# Altium schematic sheet 14 WIFI BT.SchDoc
size 513 x 386 mm
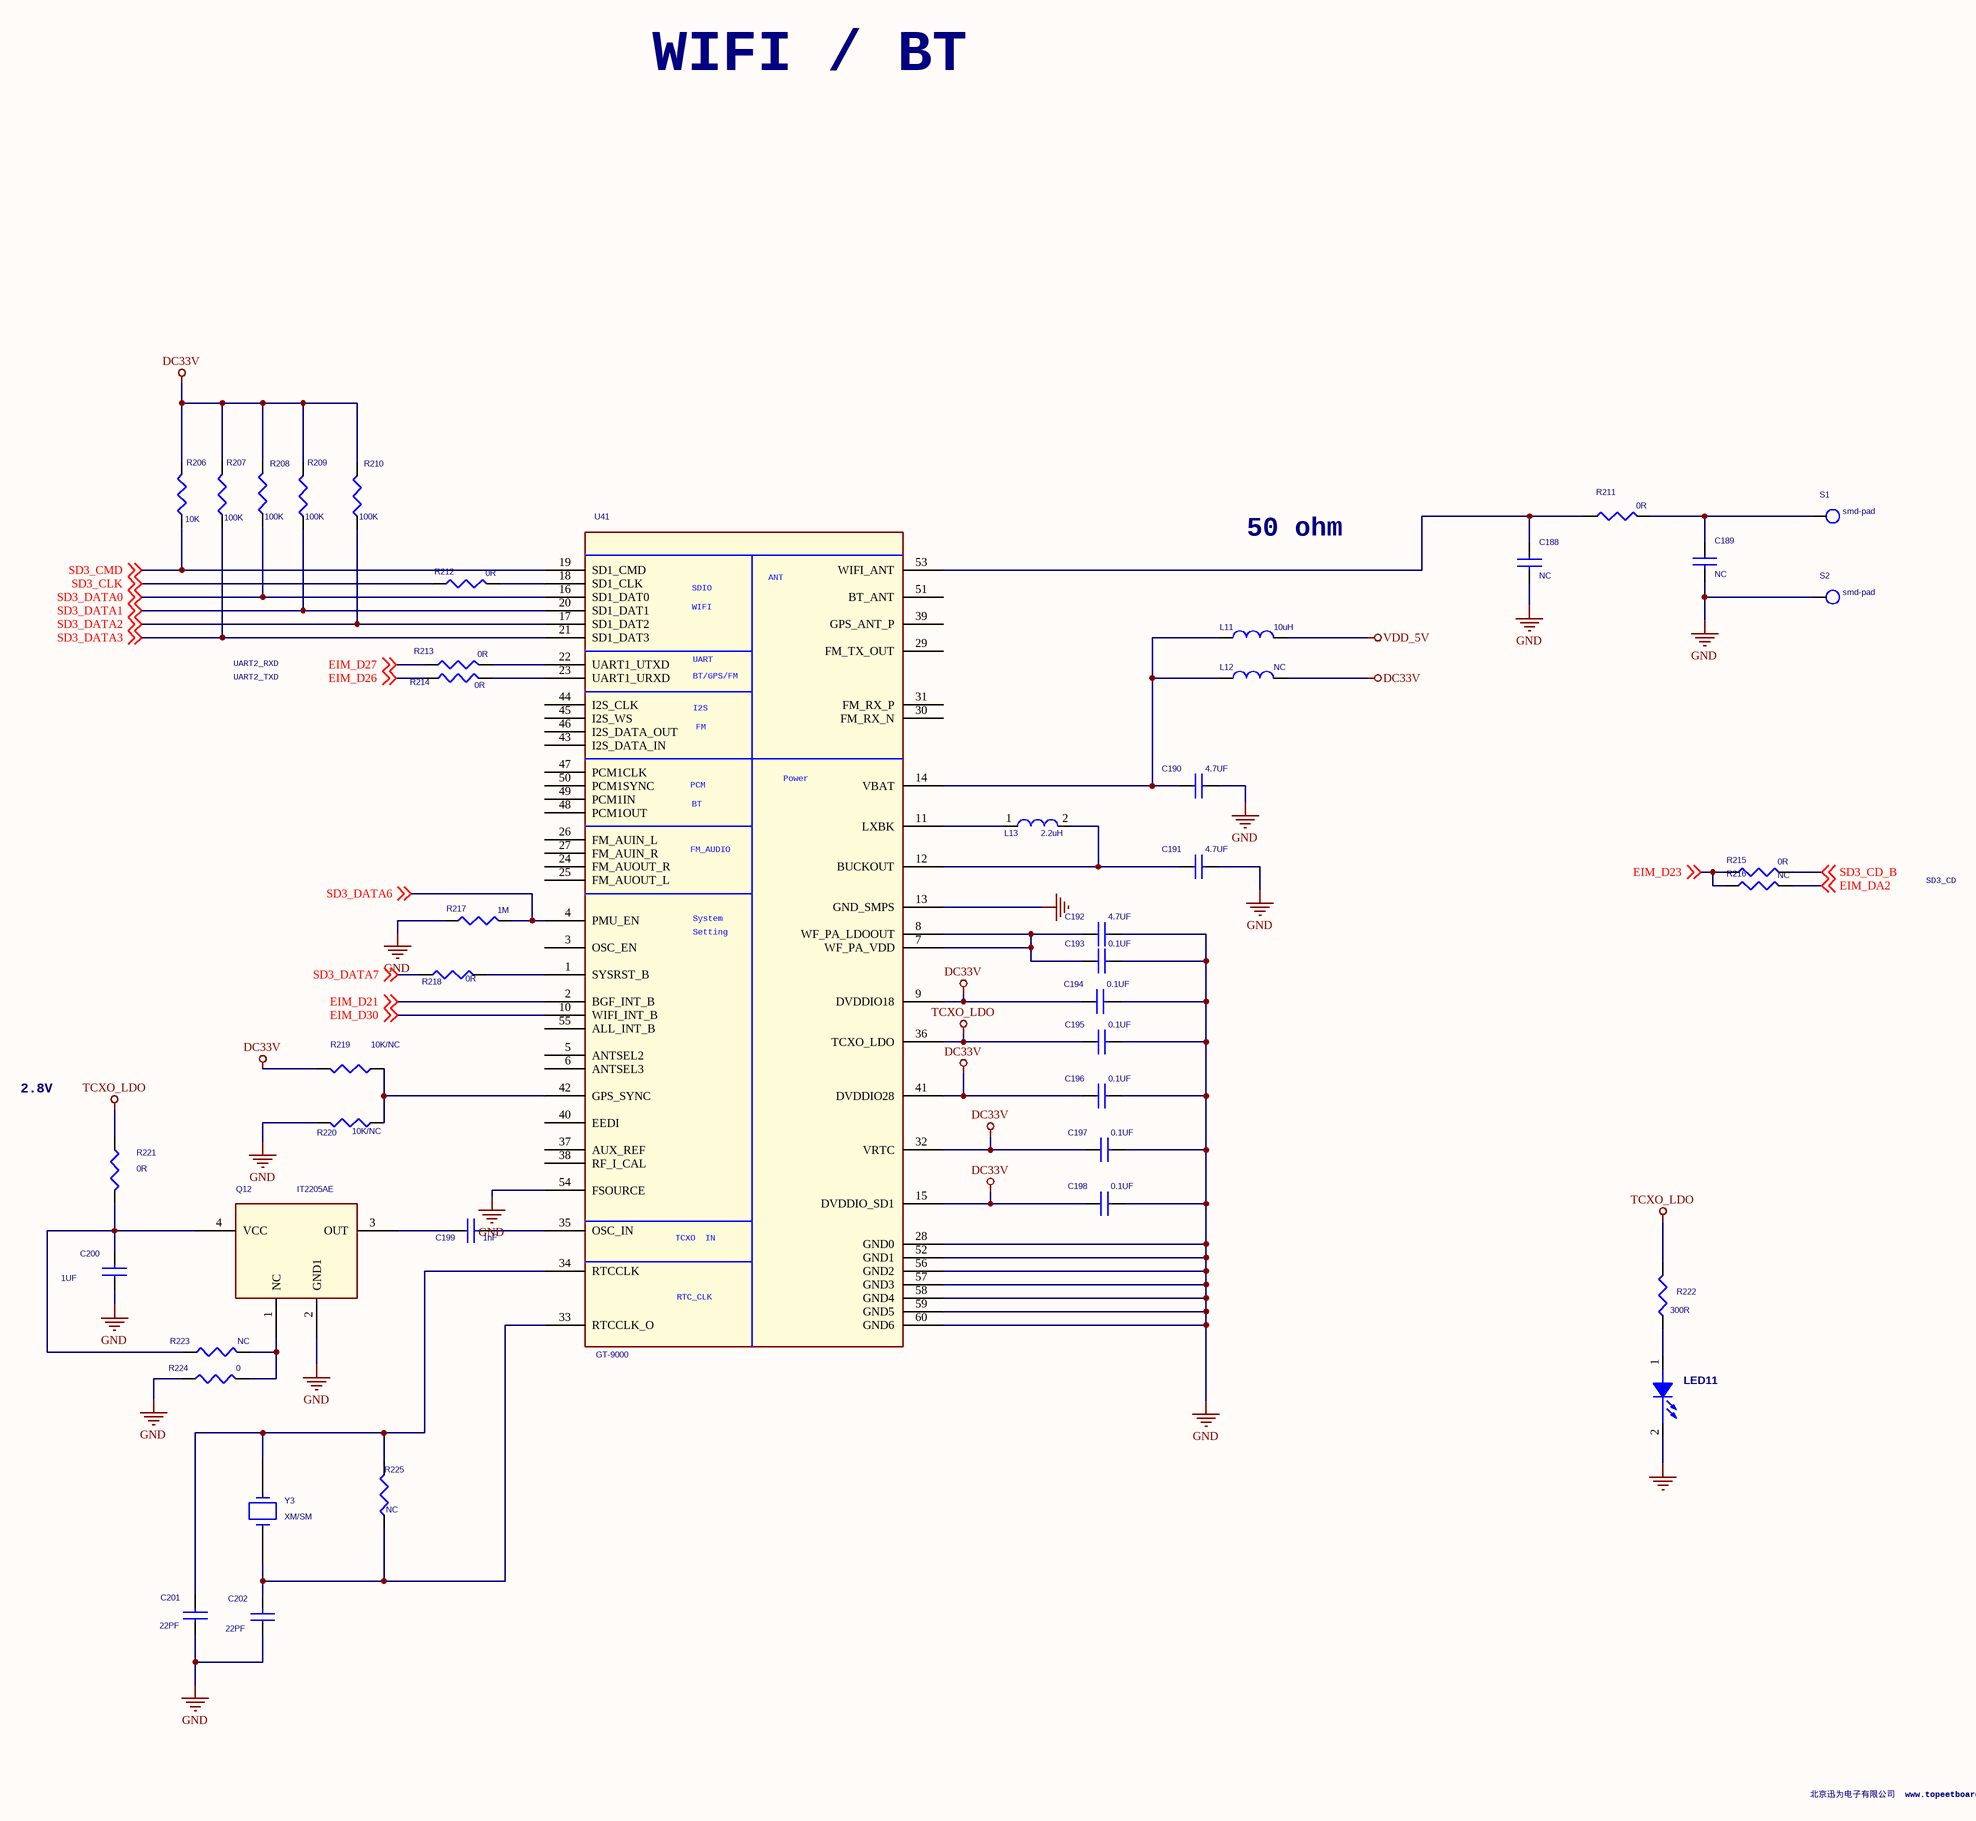
[diagram p0: 14 WIFI BT.SchDoc]

## Parts
C188  NC  [C1005]
C189  NC  [C1005]
C190  4.7UF  [C1005]
C191  4.7UF  [C1005]
C192  4.7UF  [C1005]
C193  0.1UF  [C1005]
C194  0.1UF  [C1005]
C195  0.1UF  [C1005]
C196  0.1UF  [C1005]
C197  0.1UF  [C1005]
C198  0.1UF  [C1005]
C199  1nF  [C1005]
C200  1UF  [C1005]
C201  22PF  [C1005]
C202  22PF  [C1005]
L11  10uH  [LQH32C]
L12  NC  [LQH32C]
L13  2.2uH  [LQH32C]
LED11  LED-Red (SMD 2012)  [LED-3216]  (value not drawn)
Q12  IT2205AE  [X4-2_5X3_2]
R206  10K  [R1005]
R207  100K  [R1005]
R208  100K  [R1005]
R209  100K  [R1005]
R210  100K  [R1005]
R211  0R  [R1005]
R212  0R  [R1005]
R213  0R  [R1005]
R214  0R  [R1005]
R215  0R  [R1005]
R216  NC  [R1005]
R217  1M  [R1005]
R218  0R  [R1005]
R219  10K/NC  [R1005]
R220  10K/NC  [R1005]
R221  0R  [R1005]
R222  300R  [R1005]
R223  NC  [R1005]
R224  0  [R1005]
R225  NC  [R1005]
S1  smd-pad  [TP_08]
S2  smd-pad  [TP_08]
U41  GT-9000  [s500m-6620]
Y3  XM/SM  [CC5V-T1A]

## Nets
DC33V: C194.1 C196.1 C197.1 C198.1 L12.2 R206.2 R207.2 R208.2 R209.2 R210.2 R219.2 U41.9(DVDDIO18) U41.15(DVDDIO_SD1) U41.32(VRTC) U41.41(DVDDIO28)
GND: C188.2 C189.2 C190.2 C191.2 C192.2 C193.2 C194.2 C195.2 C196.2 C197.2 C198.2 C200.1 C201.1 C202.1 LED11.2(CATHODE) Q12.2(GND1) R217.1 R220.2 R224.1 S2.1 U41.13(GND_SMPS) U41.28(GND0) U41.52(GND1) U41.54(FSOURCE) U41.56(GND2) U41.57(GND3) U41.58(GND4) U41.59(GND5) U41.60(GND6)
TCXO_LDO: C195.1 R221.1 R222.2 U41.36(TCXO_LDO)
VDD_5V: L11.2
EIM_D21: U41.2(BGF_INT_B) ; off-sheet EIM_D21
EIM_D23: R215.1 R216.1 ; off-sheet EIM_D23
EIM_D26: R214.1 ; off-sheet EIM_D26
EIM_D27: R213.1 ; off-sheet EIM_D27
EIM_D30: U41.10(WIFI_INT_B) ; off-sheet EIM_D30
EIM_DA2: R216.2 ; off-sheet EIM_DA2
SD3_CD_B: R215.2 ; off-sheet SD3_CD_B
SD3_CLK: R212.1 ; off-sheet SD3_CLK
SD3_CMD: R206.1 U41.19(SD1_CMD) ; off-sheet SD3_CMD
SD3_DATA0: R208.1 U41.16(SD1_DAT0) ; off-sheet SD3_DATA0
SD3_DATA1: R209.1 U41.20(SD1_DAT1) ; off-sheet SD3_DATA1
SD3_DATA2: R210.1 U41.17(SD1_DAT2) ; off-sheet SD3_DATA2
SD3_DATA3: R207.1 U41.21(SD1_DAT3) ; off-sheet SD3_DATA3
SD3_DATA6: R217.2 U41.4(PMU_EN) ; off-sheet SD3_DATA6
SD3_DATA7: R218.1 ; off-sheet SD3_DATA7
NetC188_1: C188.1 R211.1 U41.53(WIFI_ANT)
NetC189_1: C189.1 R211.2 S1.1
NetC190_1: C190.1 L11.1 L12.1 U41.14(VBAT)
NetC191_1: C191.1 L13.2 U41.12(BUCKOUT)
NetC192_1: C192.1 C193.1 U41.7(WF_PA_VDD) U41.8(WF_PA_LDOOUT)
NetC199_1: C199.1 Q12.3(OUT)
NetC199_2: C199.2 U41.35(OSC_IN)
NetC200_2: C200.2 Q12.4(VCC) R221.2 R223.1
NetC201_2: C201.2 R225.2 U41.34(RTCCLK) Y3.2
NetC202_2: C202.2 R225.1 U41.33(RTCCLK_O) Y3.1
NetL13_1: L13.1 U41.11(LXBK)
NetLED11_1: LED11.1(ANODE) R222.1
NetQ12_1: Q12.1(NC) R223.2 R224.2
NetR212_2: R212.2 U41.18(SD1_CLK)
NetR213_2: R213.2 U41.22(UART1_UTXD)
NetR214_2: R214.2 U41.23(UART1_URXD)
NetR218_2: R218.2 U41.1(SYSRST_B)
NetR219_1: R219.1 R220.1 U41.42(GPS_SYNC)

Not connected (* = marked no-connect by the designer): U41 3(OSC_EN) 5(ANTSEL2) 6(ANTSEL3) 24(FM_AUOUT_R) 25(FM_AUOUT_L) 26(FM_AUIN_L) 27(FM_AUIN_R) 29(FM_TX_OUT) 30(FM_RX_N) 31(FM_RX_P) 37(AUX_REF) 38(RF_I_CAL) 39(GPS_ANT_P) 40(EEDI) 43(I2S_DATA_IN) 44(I2S_CLK) 45(I2S_WS) 46(I2S_DATA_OUT) 47(PCM1CLK) 48(PCM1OUT) 49(PCM1IN) 50(PCM1SYNC) 51(BT_ANT) 55(ALL_INT_B)

## Notes on the sheet
- WIFI / BT
- 50 ohm
- UART2_TXD
- UART2_RXD
- SD3_CD
- 2.8V
- 北京迅为电子有限公司  www.topeetboard.com
- (in symbol GT-9000_0) ANT; SDIO; WIFI; UART; BT/GPS/FM; I2S; FM; Power; PCM; BT; FM_AUDIO; System; Setting; TCXO  IN; RTC_CLK

## Library data of the parts
C188-C202 = C1005_Dup1
L11 L12 = LQH32C_0
L13 = LQH32C_0_Dup1
LED11 = LED-RED_SMD_1
Q12 = IT2205AE_1
R206-R221 R223-R225 = R1005_0_Dup1
R222 = R1005_0_Dup2
S1 S2 = TP_P0_0.8_D0
U41 = GT-9000_0